# EAGLE design nachelles-with-led-drivers (EAGLE 5.11)
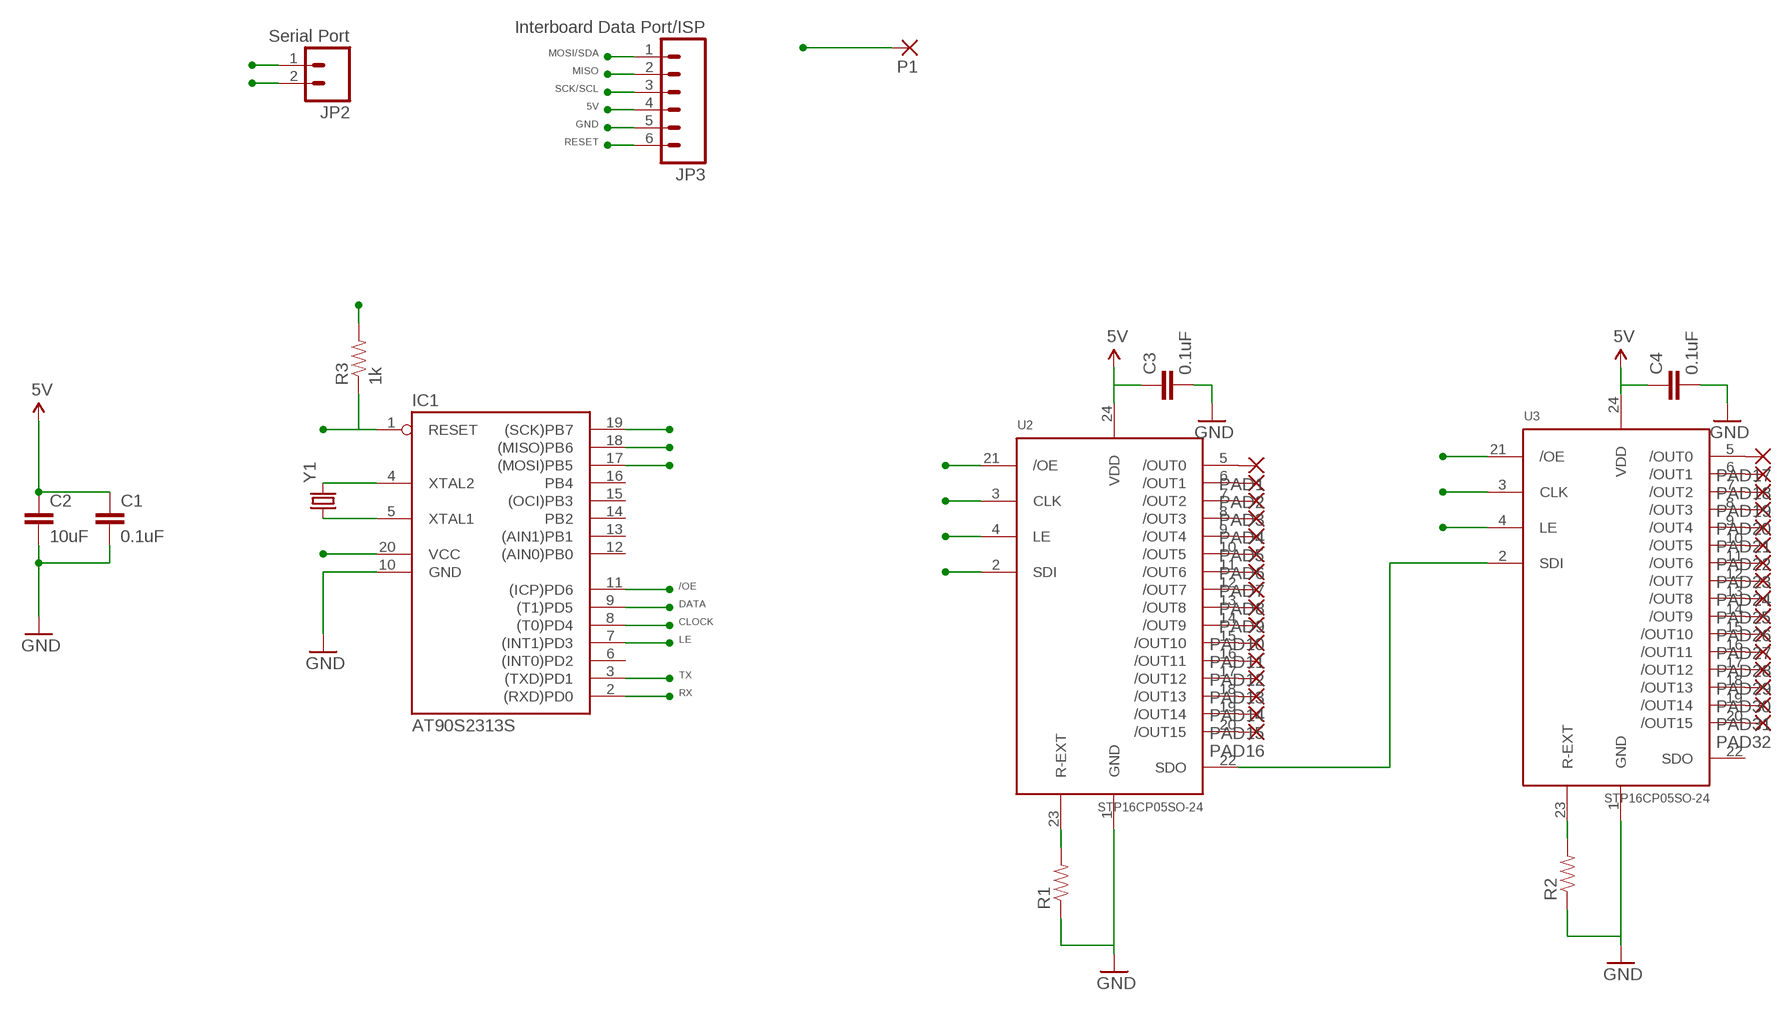
[diagram p0: schematic, sheet 1]

## Parts
C1  0.1uF  CAP1206  [1206]
C2  10uF  CAPPTH  [CAP-PTH-SMALL]
C3  0.1uF  CAP1206  [1206]
C4  0.1uF  CAP1206  [1206]
IC1  AT90S2313S  [SO20L]
JP2  Serial Port  M02PTH  [1X02]
JP3  Interboard Data Port/ISP  M06SMD  [1X06-SMD]
P1  SMD2  [SMD1,27-2,54]
PAD1  SMD2  [SMD1,27-2,54]
PAD2  SMD2  [SMD1,27-2,54]
PAD3  SMD2  [SMD1,27-2,54]
PAD4  SMD2  [SMD1,27-2,54]
PAD5  SMD2  [SMD1,27-2,54]
PAD6  SMD2  [SMD1,27-2,54]
PAD7  SMD2  [SMD1,27-2,54]
PAD8  SMD2  [SMD1,27-2,54]
PAD9  SMD2  [SMD1,27-2,54]
PAD10  SMD2  [SMD1,27-2,54]
PAD11  SMD2  [SMD1,27-2,54]
PAD12  SMD2  [SMD1,27-2,54]
PAD13  SMD2  [SMD1,27-2,54]
PAD14  SMD2  [SMD1,27-2,54]
PAD15  SMD2  [SMD1,27-2,54]
PAD16  SMD2  [SMD1,27-2,54]
PAD17  SMD2  [SMD1,27-2,54]
PAD18  SMD2  [SMD1,27-2,54]
PAD19  SMD2  [SMD1,27-2,54]
PAD20  SMD2  [SMD1,27-2,54]
PAD21  SMD2  [SMD1,27-2,54]
PAD22  SMD2  [SMD1,27-2,54]
PAD23  SMD2  [SMD1,27-2,54]
PAD24  SMD2  [SMD1,27-2,54]
PAD25  SMD2  [SMD1,27-2,54]
PAD26  SMD2  [SMD1,27-2,54]
PAD27  SMD2  [SMD1,27-2,54]
PAD28  SMD2  [SMD1,27-2,54]
PAD29  SMD2  [SMD1,27-2,54]
PAD30  SMD2  [SMD1,27-2,54]
PAD31  SMD2  [SMD1,27-2,54]
PAD32  SMD2  [SMD1,27-2,54]
R1  RESISTOR1206  [1206]
R2  RESISTOR1206  [1206]
R3  1k  RESISTOR1206  [1206]
U2  STP16CP05SO-24  [SO-24]
U3  STP16CP05SO-24  [SO-24]
Y1  CRYSTAL5X3  [CRYSTAL-SMD-5X3]

## Nets
5V: C1.1 C2.1 C3.1 C4.1 IC1.20(VCC) JP3.4 P1.1(P) R3.2 U2.24(VDD) U3.24(VDD)
/OE: IC1.11((ICP)PD6) U2.21(/OE) U3.21(/OE)
CLK: IC1.8((T0)PD4) U2.3(CLK) U3.3(CLK)
DATA: IC1.9((T1)PD5) U2.2(SDI)
GND: C1.2 C2.2 C3.2 C4.2 IC1.10(GND) JP3.5 R1.1 R2.1 U2.1(GND) U3.1(GND)
LE: IC1.7((INT1)PD3) U2.4(LE) U3.4(LE)
MISO: IC1.18((MISO)PB6) JP3.2
MOSI/SDA: IC1.17((MOSI)PB5) JP3.1
N$1: R1.2 U2.23(R-EXT)
N$3: R2.2 U3.23(R-EXT)
N$4: PAD1.1(P) U2.5(/OUT0)
N$5: PAD2.1(P) U2.6(/OUT1)
N$6: PAD3.1(P) U2.7(/OUT2)
N$7: PAD4.1(P) U2.8(/OUT3)
N$8: PAD6.1(P) U2.10(/OUT5)
N$10: IC1.5(XTAL1) Y1.1
N$11: PAD7.1(P) U2.11(/OUT6)
N$12: IC1.4(XTAL2) Y1.3
N$13: PAD8.1(P) U2.12(/OUT7)
N$14: PAD9.1(P) U2.13(/OUT8)
N$15: PAD10.1(P) U2.14(/OUT9)
N$16: PAD11.1(P) U2.15(/OUT10)
N$17: PAD12.1(P) U2.16(/OUT11)
N$18: PAD13.1(P) U2.17(/OUT12)
N$19: PAD14.1(P) U2.18(/OUT13)
N$20: PAD15.1(P) U2.19(/OUT14)
N$21: PAD16.1(P) U2.20(/OUT15)
N$22: PAD17.1(P) U3.5(/OUT0)
N$23: PAD18.1(P) U3.6(/OUT1)
N$24: PAD19.1(P) U3.7(/OUT2)
N$25: PAD20.1(P) U3.8(/OUT3)
N$26: PAD21.1(P) U3.9(/OUT4)
N$27: PAD23.1(P) U3.11(/OUT6)
N$28: PAD24.1(P) U3.12(/OUT7)
N$29: PAD25.1(P) U3.13(/OUT8)
N$30: PAD26.1(P) U3.14(/OUT9)
N$31: PAD27.1(P) U3.15(/OUT10)
N$32: PAD28.1(P) U3.16(/OUT11)
N$33: PAD29.1(P) U3.17(/OUT12)
N$34: PAD30.1(P) U3.18(/OUT13)
N$35: PAD31.1(P) U3.19(/OUT14)
N$36: PAD32.1(P) U3.20(/OUT15)
N$37: PAD5.1(P) U2.9(/OUT4)
N$38: PAD22.1(P) U3.10(/OUT5)
RESET: IC1.1(RESET) JP3.6 R3.1
RXD: IC1.2((RXD)PD0) JP2.2
S_DATA_2: U2.22(SDO) U3.2(SDI)
SCK/SCL: IC1.19((SCK)PB7) JP3.3
TXD: IC1.3((TXD)PD1) JP2.1
Unconnected: IC1.6((INT0)PD2) IC1.12((AIN0)PB0) IC1.13((AIN1)PB1) IC1.14(PB2) IC1.15((OCI)PB3) IC1.16(PB4) U3.22(SDO)

## Notes on the sheet
- MOSI/SDA
- MISO
- SCK/SCL
- 5V
- GND
- RESET
- /OE
- DATA
- CLOCK
- LE
- TX
- RX

## Library data of the parts
C1-C4 = SparkFun:CAP: Capacitor Standard 0603 ceramic capacitor, and 0.1" leaded capacitor.
IC1 = atmel:AT90S2313: MICROCONTROLLER 2 Kbytes FLASH 128 bytes SRAM 128 bytes EEPROM UART; OC_FARNELL: unknown; OC_NEWARK: unknown
JP2 = SparkFun:M02: Header 2 Standard 2-pin 0.1" header. Use with straight break away headers (SKU : PRT-00116), right angle break away headers (PRT-00553), swiss pins (PRT-00743), machine pins (PRT-00117), and female headers (PRT-00115). Molex polarized connector foot print use with SKU : PRT-08233 with associated crimp pins and housings.
JP3 = SparkFun:M06: Header 6 Standard 6-pin 0.1" header. Use with straight break away headers (SKU : PRT-00116), right angle break away headers (PRT-00553), swiss pins (PRT-00743), machine pins (PRT-00117), and female headers (PRT-00115). Molex polarized connector foot print use with SKU : PRT-08094 with associated crimp pins and housings. NOTES ON THE VARIANTS LOCK and LOCK_LONGPADS... This footprint was designed to help hold the alignment of a through-hole component (i.e. 6-pin header) while soldering it into place. You may notice that each hole has been shifted either up or down by 0.005 of an inch from it's more standard position (which is a perfectly straight line). This slight alteration caused the pins (the squares in the middle) to touch the edges of the holes. Because they are alternating, it causes a "brace" to hold the component in place. 0.005 has proven to be the perfect amount of "off-center" position when using our standard breakaway headers. Although looks a little odd when you look at the bare footprint, once you have a header in there, the alteration is very hard to notice. Also, if you push a header all the way into place, it is covered up entirely on the bottom side. This idea of altering the position of holes to aid alignment will be further integrated into the Sparkfun Library for other footprints. It can help hold any component with 3 or more connection pins.
P1 PAD1-PAD32 = wirepad:SMD2: SMD PAD
R1-R3 = SparkFun:RESISTOR: Resistor Basic schematic elements and footprints for 0603, 1206, and PTH resistors.
U2 U3 = Synapseware:STP16CP05
Y1 = SparkFun:CRYSTAL: Crystals Various standard crystals. Proven footprints. Spark Fun Electronics SKU : COM-00534

## Board
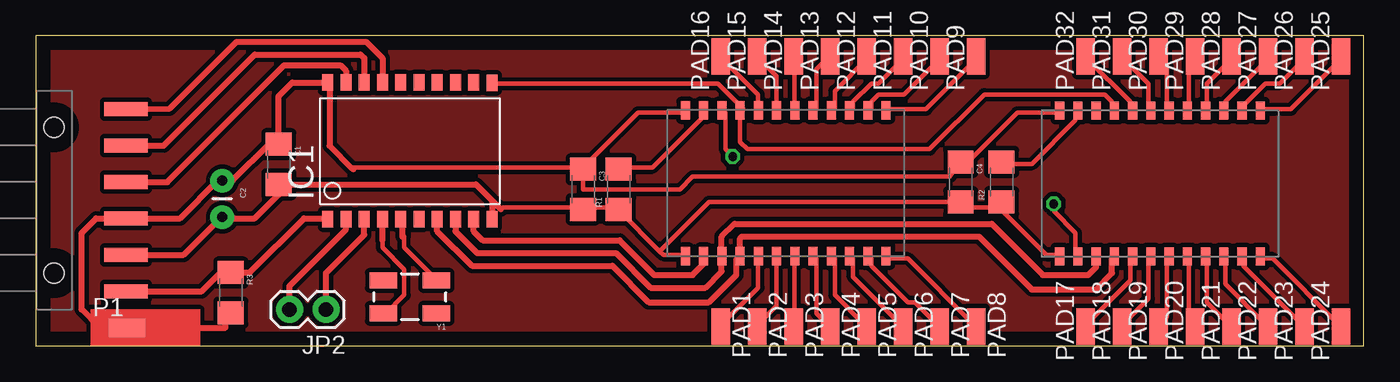
[diagram p1: board, top side]
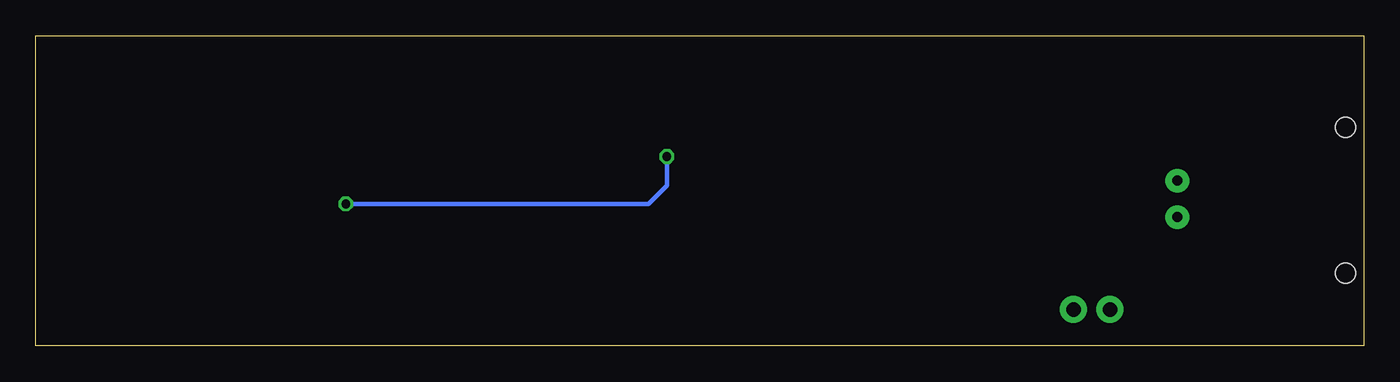
[diagram p2: board, bottom side, seen from below]

Size 92.44 x 21.61 mm. Coordinates in mm from the lower left corner, seen from the top.
Outline: 0,0 92.44,0 92.44,21.61 0,21.61 0,0
Copper layers (1*16): Top 0.035mm / dielectric 1.5mm / Bottom 0.035mm
Design rules "default *": minimum track width 12mil, minimum drill 24mil, track to track 10mil, track to pad 10mil, pad to pad 10mil, via to via 10mil, smd to smd 10mil, copper to edge 40mil, drill to drill 8mil, minimum pad ring 10mil, minimum via ring 8mil, stop-mask expansion 4mil, vias tented up to drill 0mil, thermal gap 10mil

### Footprints (pad centres in the part's own frame; a part is rotated, then mirrored left to right if it is on the bottom)
1206 = smd 1.6 x 1.8: 1 -1.4,0; 2 1.4,0
CAP-PTH-SMALL = drill 0.7 pad 1.651 round: 1 0,0; 2 2.54,0
SO20L = smd 0.762 x 1.143: 1 -5.08,-5.131; 2 -3.81,-5.131; 3 -2.54,-5.131; 4 -1.27,-5.131; 5 0,-5.131; 6 1.27,-5.131; 7 2.54,-5.131; 8 3.81,-5.131; 9 5.08,-5.131; 10 6.35,-5.131; 11 6.35,4.369; 12 5.08,4.394; 13 3.81,4.394; 14 2.54,4.394; 15 1.27,4.394; 16 0,4.394; 17 -1.27,4.394; 18 -2.54,4.394; 19 -3.81,4.394; 20 -5.08,4.394
1X02 = drill 1.016 pad 1.88 round: 1 0,0; 2 2.54,0
1X06-SMD = smd 1 x 3: 1 -6.35,5; 2 -3.81,5; 3 -1.27,5; 4 1.27,5; 5 3.81,5; 6 6.35,5 | hole 1.4: -5.08,0; 5.08,0
SMD1,27-2,54 = smd 1.27 x 2.54: 1 0,0
SO-24 = smd 1.27 x 0.635: 1 -5.08,7.62; 2 -5.08,6.35; 3 -5.08,5.08; 4 -5.08,3.81; 5 -5.08,2.54; 6 -5.08,1.27; 7 -5.08,0; 8 -5.08,-1.27; 9 -5.08,-2.54; 10 -5.08,-3.81; 11 -5.08,-5.08; 12 -5.08,-6.35; 13 5.08,-6.35; 14 5.08,-5.08; 15 5.08,-3.81; 16 5.08,-2.54; 17 5.08,-1.27; 18 5.08,0; 19 5.08,1.27; 20 5.08,2.54; 21 5.08,3.81; 22 5.08,5.08; 23 5.08,6.35; 24 5.08,7.62
CRYSTAL-SMD-5X3 = smd 1.9 x 1.1: 1 -1.85,-1.15; 2 1.85,-1.15; 3 1.85,1.15; 4 -1.85,1.15

### Placement (x,y rotation side)
C1  16.91,12.67 270 top
C2  12.97,11.53 270 top
C3  38.1,10.92 270 top
C4  64.39,11.43 270 top
IC1  25.4,13.97 0 top
JP2  20.19,2.54 180 top
JP3  1.27,10.16 270 top
P1  6.35,1.27 270 top
PAD1  47.69,1.36 180 top
PAD2  50.23,1.36 180 top
PAD3  52.77,1.36 180 top
PAD4  55.31,1.36 180 top
PAD5  57.85,1.36 180 top
PAD6  60.39,1.36 180 top
PAD7  62.93,1.36 180 top
PAD8  65.47,1.36 180 top
PAD9  65.47,20.19 0 top
PAD10  62.93,20.19 0 top
PAD11  60.39,20.19 0 top
PAD12  57.85,20.19 0 top
PAD13  55.31,20.19 0 top
PAD14  52.77,20.19 0 top
PAD15  50.23,20.19 0 top
PAD16  47.69,20.19 0 top
PAD17  73.09,1.36 0 top
PAD18  75.63,1.36 0 top
PAD19  78.17,1.36 0 top
PAD20  80.71,1.36 0 top
PAD21  83.25,1.36 0 top
PAD22  85.79,1.36 0 top
PAD23  88.33,1.36 0 top
PAD24  90.87,1.36 0 top
PAD25  90.87,20.19 0 top
PAD26  88.33,20.19 0 top
PAD27  85.79,20.19 0 top
PAD28  83.25,20.19 0 top
PAD29  80.71,20.19 0 top
PAD30  78.17,20.19 0 top
PAD31  75.63,20.19 0 top
PAD32  73.09,20.19 0 top
R1  40.58,10.92 90 top
R2  67.23,11.43 90 top
R3  13.57,3.71 270 top
U2  52.84,11.35 90 top
U3  78.9,11.32 90 top
Y1  26.04,3.43 180 top

### Tracks (layer width: path | path; a pad name or v marks a point on that pad's centre or on a via)
5V
  Top 0.305: U3.24 71.12,16.26 68.33,16.26 64.52,12.45 C4.1 63.63,11.81 45.72,11.81 44.83,10.92 38.1,10.92 C3.1 38.1,12.45 | 38.1,12.45 41.91,16.26 45.21,16.26 U2.24 | 38.1,12.45 22.1,12.45 22.04,12.38
  Top 0.406: R3.2 13.21,1.95 13.21,1.27 P1.1 4.45,1.27 3.17,2.54 3.17,7.87 4.19,8.89 JP3.4 10.03,8.89 12.67,11.53 C2.1 13,11.56 13.72,11.56 16.23,14.07 C1.1 16.89,14.08 16.89,17.4 17.86,18.36 IC1.20 20.45,18.24 20.45,13.97 22.04,12.38 22.09,12.32
/OE
  Top 0.305: IC1.11 31.75,18.29 47.5,18.29 49.28,16.51 U2.21 49.02,16.26 49.02,14.22 49.53,13.72 62.23,13.72 66.04,17.53 74.42,17.53 74.93,17.02 74.93,16.51 U3.21
CLK
  Top 0.406: IC1.8 29.21,8 30.73,6.48 40.39,6.48 42.8,4.06 46.61,4.06 47.75,5.21 U2.3 47.75,7.62 48.64,8.51 66.55,8.51 70.1,4.95 73.28,4.95 73.82,5.5 U3.3
DATA
  Top 0.406: IC1.9 30.48,8 31.11,7.37 40.64,7.37 43.05,4.95 45.72,4.95 46.48,5.71 U2.2
GND
  Top 0.305: U3.1 71.12,6.35 70.36,6.35 67.31,9.4 R2.1 67.06,9.65 64.52,9.65 C4.2 47.12,10.03 46.86,10.03 43.43,6.6 | 43.43,6.6 40.64,9.4 R1.1 40.39,9.65 38.1,9.65 | 43.43,6.6 43.69,6.35 45.21,6.35 U2.1 | 38.1,9.65 32.51,9.65 32.38,9.53 | 38.1,9.65 C3.2
  Top 0.406: JP3.5 10.29,6.35 12.92,8.98 C2.2 13.06,8.89 15.24,8.89 16.91,10.56 C1.2 30.64,11.27 31.75,10.16 | 31.75,10.16 IC1.10 | 31.75,10.16 32.38,9.53 32.39,9.52
LE
  Top 0.406: IC1.7 27.94,8 30.35,5.59 40.13,5.59 42.67,3.05 46.86,3.05 48.77,4.95 48.77,6.01 U2.4 49.03,7.5 49.15,7.62 65.66,7.62 69.34,3.94 73.79,3.94 74.93,5.08 74.93,6.08 U3.4
MISO
  Top 0.406: IC1.18 22.86,20.07 22.61,20.32 15.24,20.32 8.89,13.97 JP3.2
MOSI/SDA
  Top 0.406: JP3.1 9.32,16.56 13.97,21.21 22.99,21.21 24.13,20.07 IC1.17
N$1
  Top 0.305: U2.23 46.48,16.26 46.48,16 42.93,12.45 40.64,12.45 R1.2
N$2
  pour Top (isolate 0.305): 0,0 0,21.59 92.71,21.59 92.71,0
N$3
  Top 0.305: U3.23 72.39,16.26 72.39,15.75 69.34,12.7 67.31,12.7 R2.2
N$4
  Top 0.305: U2.5 50.29,6.1 50.29,4.06 47.75,1.52 PAD1.1
N$5
  Top 0.305: U2.6 51.56,6.1 51.56,2.79 50.29,1.52 PAD2.1
N$6
  Top 0.305: U2.7 52.83,6.1 52.83,1.52 PAD3.1
N$7
  Top 0.305: U2.8 54.36,6.1 54.36,2.29 55.12,1.52 PAD4.1
N$8
  Top 0.305: U2.10 56.9,6.1 56.9,4.83 60.2,1.52 PAD6.1
N$10
  Top 0.305: 25.53,7.62 25.65,7.62 25.65,6.86 27.69,4.83 Y1.1
  Top 0.406: 25.53,7.62 25.53,8.71 IC1.5
N$11
  Top 0.305: U2.11 58.17,6.1 58.17,5.59 60.71,3.05 61.21,3.05 62.74,1.52 PAD7.1
N$12
  Top 0.305: 24.13,7.37 24.13,6.86 25.65,5.33 25.65,3.56 24.38,2.29 Y1.3
  Top 0.406: 24.13,7.37 IC1.4
N$13
  Top 0.305: U2.12 59.44,6.1 60.71,6.1 65.28,1.52 PAD8.1
N$14
  Top 0.305: U2.13 59.44,16.51 61.98,16.51 65.53,20.07 PAD9.1
N$15
  Top 0.305: U2.14 58.17,16.51 58.17,17.02 58.67,17.53 60.45,17.53 62.99,20.07 PAD10.1
N$16
  Top 0.305: U2.15 56.9,16.51 56.9,17.02 58.17,18.29 58.67,18.29 60.45,20.07 PAD11.1
N$17
  Top 0.305: U2.16 55.63,16.51 55.63,17.78 57.91,20.07 PAD12.1
N$18
  Top 0.305: U2.17 54.36,16.51 54.36,19.3 55.12,20.07 PAD13.1
N$19
  Top 0.305: U2.18 52.83,16.51 52.83,20.07 PAD14.1
N$20
  Top 0.305: U2.19 51.56,16.51 51.56,18.8 50.29,20.07 PAD15.1
N$21
  Top 0.305: U2.20 50.29,16.51 50.29,17.53 47.75,20.07 PAD16.1
N$22
  Top 0.305: U3.5 76.2,6.1 76.2,4.57 73.15,1.52 PAD17.1
N$23
  Top 0.305: U3.6 77.47,6.1 77.47,3.3 75.69,1.52 PAD18.1
N$24
  Top 0.305: U3.7 78.74,6.1 78.74,2.03 78.23,1.52 PAD19.1
N$25
  Top 0.305: U3.8 80.26,6.1 80.26,1.78 80.52,1.52 PAD20.1
N$26
  Top 0.305: U3.9 81.53,6.1 81.53,3.05 83.06,1.52 PAD21.1
N$27
  Top 0.305: U3.11 84.07,6.1 84.07,5.59 88.14,1.52 PAD23.1
N$28
  Top 0.305: U3.12 85.34,6.1 86.11,6.1 90.68,1.52 PAD24.1
N$29
  Top 0.305: U3.13 85.34,16.51 87.38,16.51 90.93,20.07 PAD25.1
N$30
  Top 0.305: U3.14 84.07,16.51 84.07,16.76 85.6,18.29 86.61,18.29 88.39,20.07 PAD26.1
N$31
  Top 0.305: U3.15 82.8,16.51 82.8,17.02 85.85,20.07 PAD27.1
N$32
  Top 0.305: U3.16 81.53,16.51 81.53,18.29 83.31,20.07 PAD28.1
N$33
  Top 0.305: U3.17 80.26,16.51 80.26,19.81 80.52,20.07 PAD29.1
N$34
  Top 0.305: U3.18 78.74,16.51 78.74,19.56 78.23,20.07 PAD30.1
N$35
  Top 0.305: U3.19 77.47,16.51 77.47,18.29 75.69,20.07 PAD31.1
N$36
  Top 0.305: U3.20 76.2,16.51 76.2,17.02 73.15,20.07 PAD32.1
N$37
  Top 0.305: U2.9 55.63,6.1 55.63,3.56 57.66,1.52 PAD5.1
N$38
  Top 0.305: U3.10 82.8,6.1 82.8,4.32 85.6,1.52 PAD22.1
RESET
  Top 0.406: JP3.6 11.56,3.81 12.86,5.12 R3.1 14.89,5.12 18.67,8.89 20.27,8.89 IC1.1
RXD
  Top 0.406: IC1.2 21.59,8.13 17.65,4.19 JP2.2
S_DATA_2  (via drill 0.61)
  Top 0.305: v48.51,13.21 48.01,13.72 48.01,16.26 U2.22 | v70.87,9.91 70.87,9.4 72.39,7.87 72.39,6.35 U3.2
  Bottom 0.305: v48.51,13.21 48.51,11.18 49.78,9.91 v70.87,9.91
SCK/SCL
  Top 0.406: JP3.3 9.14,11.43 17.27,19.56 21.21,19.56 21.59,19.18 IC1.19
TXD
  Top 0.406: JP2.1 20.19,5.08 22.86,7.75 IC1.3
(copper drawn outside any net)
  shapes: Top area x1